# Altium project Adattatore_4.2_5_v2_GitHUB.PrjPcb
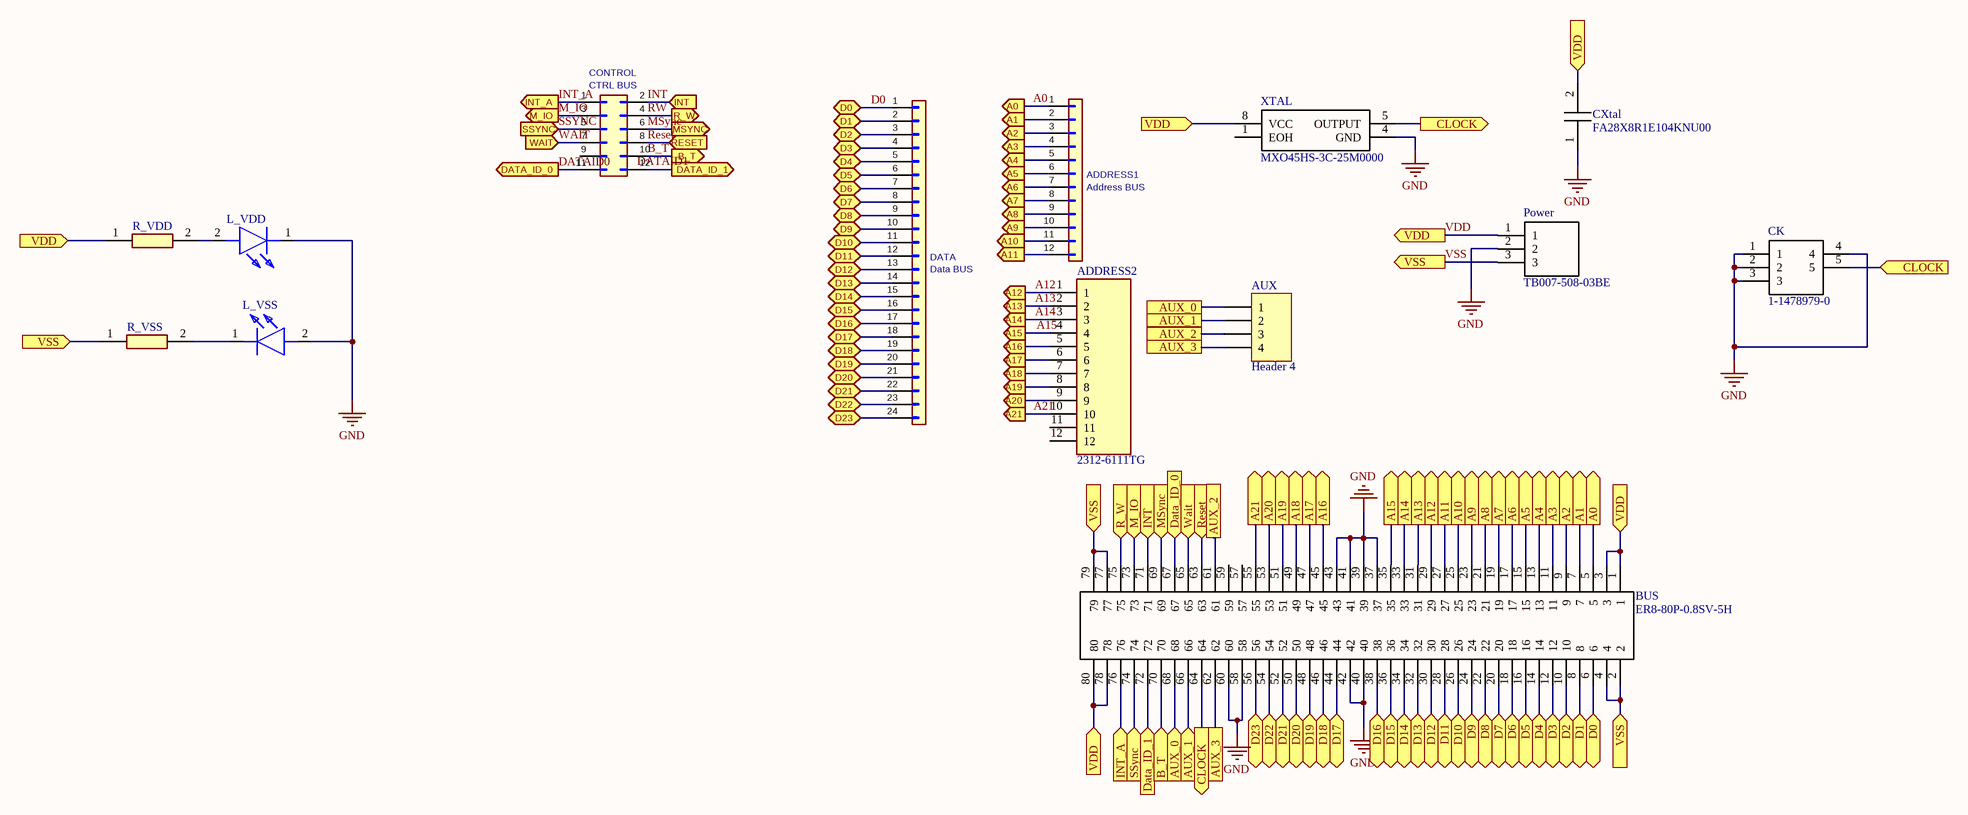
[diagram p0: Adattatore.SchDoc]
1 sheet, 14 parts. Net scope: flat (ports and power ports of the same name join across sheets).
Board file: Adattatore.PcbDoc

## Sheet Adattatore.SchDoc
size A0; SheetNumber: 1; SheetTotal: 1

### Parts
ADDRESS1  Address BUS  [PinHeader_1x12_P2.54mm_Vertical]
ADDRESS2  2312-6111TG  [HDRV12W82P0X254_1X12_3048X254X864P]
AUX  Header 4  [HDR1X4]
BUS  ER8-80P-0.8SV-5H  [ER880P08SV5H]
CK  1-1478979-0  [114789790]
CONTROL  CTRL BUS  [PinHeader_2x06_P2.54mm_Vertical]
CXtal  FA28X8R1E104KNU00  [FA28C0G1H822JNU00]
DATA  Data BUS  [PinHeader_1x24_P2.54mm_Vertical]
L_VDD  150060VS55040  [LEDM168X50N]  (value not drawn)
L_VSS  150060SS75003  [150060SS75003]  (value not drawn)
Power  TB007-508-03BE  [TB00750803BE]
R_VDD  CRCW06031K00JNEAC  [RESC1608X55N]  (value not drawn)
R_VSS  CRCW06031K00JNEAC  [RESC1608X55N]  (value not drawn)
XTAL  MXO45HS-3C-25M0000  [MXO45HS3C25M0000]

### Ports
A0 (out), A1 (out), A2 (out), A3 (out), A4 (out), A5 (out), A6 (out), A7 (out), A8 (out), A9 (out), A10 (out), A11 (out), A12 (out), A13 (out), A14 (out), A15 (out), A16 (out), A17 (out), A18 (out), A19 (out), A20 (out), A21 (out), AUX_0, AUX_0 (in), AUX_1, AUX_1 (in), AUX_2, AUX_3, B_T (in), B_T (out), CLOCK (in), CLOCK (out), D0 (bidir), D1 (bidir), D2 (bidir), D3 (bidir), D4 (bidir), D5 (bidir), D6 (bidir), D7 (bidir), D8 (bidir), D9 (bidir), D10 (bidir), D11 (bidir), D12 (bidir), D13 (bidir), D14 (bidir), D15 (bidir), D16 (bidir), D17 (bidir), D18 (bidir), D19 (bidir), D20 (bidir), D21 (bidir), D22 (bidir), D23 (bidir), Data_ID_0 (in), DATA_ID_0 (out), Data_ID_1 (in), DATA_ID_1 (out), INT (in), INT_A (in), INT_A (out), M_IO (in), M_IO (out), MSync (in), MSYNC (out), R_W (in), R_W (out), RESET (in), Reset (in), SSYNC (in), SSync (in), VDD (in), VDD (out), VSS (in), VSS (out), WAIT (in), Wait (in)

### Nets
GND: BUS.37 BUS.39 BUS.40 BUS.41 BUS.42 BUS.43 BUS.58 BUS.60 CK.1 CK.2 CK.3 CK.4 CXtal.1 L_VDD.1(K) L_VSS.2(A) Power.2 XTAL.4(GND)
A0: ADDRESS1.1(Pin_1) BUS.5 ; port A0
A12: ADDRESS2.1 BUS.29 ; port A12
A13: ADDRESS2.2 BUS.31 ; port A13
A14: ADDRESS2.3 BUS.33 ; port A14
A15: ADDRESS2.4 BUS.35 ; port A15
A21: ADDRESS2.10 BUS.55 ; port A21
B_T: BUS.70 CONTROL.10(Pin_10) ; port B_T
D0: BUS.6 DATA.1(Pin_1) ; port D0
DATAID0: BUS.67 CONTROL.11(Pin_11) ; port DATA_ID_0, port Data_ID_0
INT: BUS.71 CONTROL.2(Pin_2) ; port INT
INT_A: BUS.76 CONTROL.1(Pin_1) ; port INT_A
M_IO: BUS.73 CONTROL.3(Pin_3) ; port M_IO
MSync: BUS.69 CONTROL.6(Pin_6) ; port MSYNC, port MSync
Reset: BUS.63 CONTROL.8(Pin_8) ; port RESET, port Reset
RW: BUS.75 CONTROL.4(Pin_4) ; port R_W
SSYNC: BUS.74 CONTROL.5(Pin_5) ; port SSYNC, port SSync
VDD: BUS.1 BUS.3 BUS.78 BUS.80 CXtal.2 Power.1 R_VDD.1 XTAL.8(VCC) ; port VDD
VSS: BUS.2 BUS.4 BUS.77 BUS.79 Power.3 R_VSS.1 ; port VSS
WAIT: BUS.65 CONTROL.7(Pin_7) ; port WAIT, port Wait
NetADDRESS1_2: ADDRESS1.2(Pin_2) BUS.7 ; port A1
NetADDRESS1_3: ADDRESS1.3(Pin_3) BUS.9 ; port A2
NetADDRESS1_4: ADDRESS1.4(Pin_4) BUS.11 ; port A3
NetADDRESS1_5: ADDRESS1.5(Pin_5) BUS.13 ; port A4
NetADDRESS1_6: ADDRESS1.6(Pin_6) BUS.15 ; port A5
NetADDRESS1_7: ADDRESS1.7(Pin_7) BUS.17 ; port A6
NetADDRESS1_8: ADDRESS1.8(Pin_8) BUS.19 ; port A7
NetADDRESS1_9: ADDRESS1.9(Pin_9) BUS.21 ; port A8
NetADDRESS1_10: ADDRESS1.10(Pin_10) BUS.23 ; port A9
NetADDRESS1_11: ADDRESS1.11(Pin_11) BUS.25 ; port A10
NetADDRESS1_12: ADDRESS1.12(Pin_12) BUS.27 ; port A11
NetADDRESS2_5: ADDRESS2.5 BUS.45 ; port A16
NetADDRESS2_6: ADDRESS2.6 BUS.47 ; port A17
NetADDRESS2_7: ADDRESS2.7 BUS.49 ; port A18
NetADDRESS2_8: ADDRESS2.8 BUS.51 ; port A19
NetADDRESS2_9: ADDRESS2.9 BUS.53 ; port A20
NetAUX_1: AUX.1 BUS.68 ; port AUX_0
NetAUX_2: AUX.2 BUS.66 ; port AUX_1
NetAUX_3: AUX.3 BUS.61 ; port AUX_2
NetAUX_4: AUX.4 BUS.62 ; port AUX_3
NetBUS_8: BUS.8 DATA.2(Pin_2) ; port D1
NetBUS_10: BUS.10 DATA.3(Pin_3) ; port D2
NetBUS_12: BUS.12 DATA.4(Pin_4) ; port D3
NetBUS_14: BUS.14 DATA.5(Pin_5) ; port D4
NetBUS_16: BUS.16 DATA.6(Pin_6) ; port D5
NetBUS_18: BUS.18 DATA.7(Pin_7) ; port D6
NetBUS_20: BUS.20 DATA.8(Pin_8) ; port D7
NetBUS_22: BUS.22 DATA.9(Pin_9) ; port D8
NetBUS_24: BUS.24 DATA.10(Pin_10) ; port D9
NetBUS_26: BUS.26 DATA.11(Pin_11) ; port D10
NetBUS_28: BUS.28 DATA.12(Pin_12) ; port D11
NetBUS_30: BUS.30 DATA.13(Pin_13) ; port D12
NetBUS_32: BUS.32 DATA.14(Pin_14) ; port D13
NetBUS_34: BUS.34 DATA.15(Pin_15) ; port D14
NetBUS_36: BUS.36 DATA.16(Pin_16) ; port D15
NetBUS_38: BUS.38 DATA.17(Pin_17) ; port D16
NetBUS_44: BUS.44 DATA.18(Pin_18) ; port D17
NetBUS_46: BUS.46 DATA.19(Pin_19) ; port D18
NetBUS_48: BUS.48 DATA.20(Pin_20) ; port D19
NetBUS_50: BUS.50 DATA.21(Pin_21) ; port D20
NetBUS_52: BUS.52 DATA.22(Pin_22) ; port D21
NetBUS_54: BUS.54 DATA.23(Pin_23) ; port D22
NetBUS_56: BUS.56 DATA.24(Pin_24) ; port D23
NetBUS_64: BUS.64 CK.5 XTAL.5(OUTPUT) ; port CLOCK
NetBUS_72: BUS.72 CONTROL.12(Pin_12) ; port DATA_ID_1, port Data_ID_1
NetL_VDD_2: L_VDD.2(A) R_VDD.2
NetL_VSS_1: L_VSS.1(K) R_VSS.2

Not connected (* = marked no-connect by the designer): ADDRESS2 11 12; BUS 57 59; CONTROL 9(Pin_9); XTAL 1(EOH)

### Notes on the sheet
- Labels drawn without touching a wire or pin: DATAID1

### Library data of the parts
ADDRESS1 = Conn_01x12: Value: Address BUS; Footprint: Connector_PinHeader_2.54mm:PinHeader_1x12_P2.54mm_Vertical
ADDRESS2 = 2312-6111TG: Connector; Manufacturer_Name: 3M; Datasheet Link: https://multimedia.3m.com/mws/media/22434O/3mtm-100-in-pin-strip-hdr-straight-ra-solder-tail-ts0766.pdf; Height: 8.636mm; Manufacturer_Part_Number: 2312-6111TG; Mouser Part Number: 517-2312-6111TG; Mouser Price/Stock: https://www.mouser.co.uk/ProductDetail/3M-Electronic-Solutions-Division/2312-6111TG?qs=kc%2FM%2FrumzCWny2wIl4PkcA%3D%3D; Arrow Part Number: 2312-6111TG; Arrow Price/Stock: https://www.arrow.com/en/products/2312-6111-tg/3m
AUX = Header 4: Header, 4-Pin; LatestRevisionDate: 17-Jul-2002; LatestRevisionNote: Re-released for DXP Platform.; Publisher: Altium Limited
BUS = ER8-80P-0.8SV-5H: Connector; Manufacturer_Name: Hirose; Datasheet Link: https://www.hirose.com/product/en/download_file/key_name/ER8-80P-0.8SV-5H/category/Drawing%20(2D)/doc_file_id/142172/?file_category_id=6&item_id=06250029000&is_series=; Height: 8.905mm; Manufacturer_Part_Number: ER8-80P-0.8SV-5H; Mouser Part Number: 798-ER8-80P-0.8SV-5H; Mouser Price/Stock: https://www.mouser.com/Search/Refine.aspx?Keyword=798-ER8-80P-0.8SV-5H
CK = 1-1478979-0: Connector; Manufacturer_Name: TE Connectivity; Datasheet Link: http://www.te.com/commerce/DocumentDelivery/DDEController?Action=showdoc&DocId=Customer+Drawing%7F1478979%7FB%7Fpdf%7FEnglish%7FENG_CD_1478979_B.pdf%7F1-1478979-0; Height: 10mm; Manufacturer_Part_Number: 1-1478979-0; Mouser Part Number: 571-1-1478979-0; Mouser Price/Stock: https://www.mouser.co.uk/ProductDetail/TE-Connectivity/1-1478979-0?qs=Vcr9%2FL0R50jLfIYfi0kfuw%3D%3D; Arrow Part Number: 1-1478979-0; Arrow Price/Stock: https://www.arrow.com/en/products/1-1478979-0/te-connectivity
CONTROL = Conn_02x06_Odd_Even: CONTROL: CTRL BUS; Footprint: Connector_PinHeader_2.54mm:PinHeader_2x06_P2.54mm_Vertical
CXtal = FA28X8R1E104KNU00: Capacitor; Manufacturer_Name: TDK; Datasheet Link: https://product.tdk.com/info/en/catalog/datasheets/leadmlcc_halogenfree_fa150_en.pdf; Height: 5.5mm; Manufacturer_Part_Number: FA28X8R1E104KNU00; Mouser Part Number: 810-FA28X8R1E10400; Mouser Price/Stock: https://www.mouser.co.uk/ProductDetail/TDK/FA28X8R1E104KNU00?qs=zFwFjAF3uahucuORXrjx8w%3D%3D
DATA = Conn_01x24: Value: Data BUS; Footprint: Connector_PinHeader_2.54mm:PinHeader_1x24_P2.54mm_Vertical
L_VDD = 150060VS55040: LED; Manufacturer_Name: Wurth Elektronik; Datasheet Link: https://katalog.we-online.com/led/datasheet/150060VS55040.pdf; Height: 0.5mm; Manufacturer_Part_Number: 150060VS55040; Mouser Part Number: 710-150060VS55040; Mouser Price/Stock: https://www.mouser.co.uk/ProductDetail/Wurth-Elektronik/150060VS55040?qs=8Aam6%252B7C6HEumg%252B0cJZzvA%3D%3D
L_VSS = 150060SS75003: LED; Manufacturer_Name: Wurth Elektronik; Datasheet Link: https://www.we-online.com/catalog/datasheet/150060SS75003.pdf; Height: 0.8mm; Manufacturer_Part_Number: 150060SS75003; Mouser Part Number: 710-150060SS75003; Mouser Price/Stock: https://www.mouser.co.uk/ProductDetail/Wurth-Elektronik/150060SS75003?qs=Li%252BoUPsLEntNiRmIe%252Bnzlg%3D%3D
Power = TB007-508-03BE: Connector; Manufacturer_Name: CUI Inc.; Datasheet Link: https://eu.mouser.com/datasheet/2/670/tb007_508-1550621.pdf; Height: 14.4mm; Manufacturer_Part_Number: TB007-508-03BE; Mouser Part Number: 490-TB007-508-03BE; Mouser Price/Stock: https://www.mouser.co.uk/ProductDetail/CUI-Devices/TB007-508-03BE?qs=vLWxofP3U2zHYiGqNs1vAA%3D%3D; Arrow Part Number: TB007-508-03BE; Arrow Price/Stock: https://www.arrow.com/en/products/tb007-508-03be/cui-devices?region=nac
R_VDD R_VSS = CRCW06031K00JNEAC: Resistor; Manufacturer_Name: Vishay; Datasheet Link: http://www.vishay.com/docs/28773/crcwce3.pdf; Height: 0.55mm; Manufacturer_Part_Number: CRCW06031K00JNEAC; Mouser Part Number: 71-CRCW06031K00JNEAC; Mouser Price/Stock: https://www.mouser.co.uk/ProductDetail/Vishay-Dale/CRCW06031K00JNEAC?qs=E3Y5ESvWgWPM5t3DlmyFHQ%3D%3D; Arrow Part Number: CRCW06031K00JNEAC; Arrow Price/Stock: https://www.arrow.com/en/products/crcw06031k00jneac/vishay?region=nac
XTAL = MXO45HS-3C-25M0000: Crystal or Oscillator; Manufacturer_Name: CTS; Datasheet Link: http://www.ctscorp.com/wp-content/uploads/MXO45.pdf; Height: 5.1mm; Manufacturer_Part_Number: MXO45HS-3C-25M0000; Mouser Part Number: 774-MXO45HS-3C-25.0; Mouser Price/Stock: https://www.mouser.com/Search/Refine.aspx?Keyword=774-MXO45HS-3C-25.0; Arrow Part Number: MXO45HS-3C-25M0000; Arrow Price/Stock: https://www.arrow.com/en/products/mxo45hs-3c-25m0000/cts